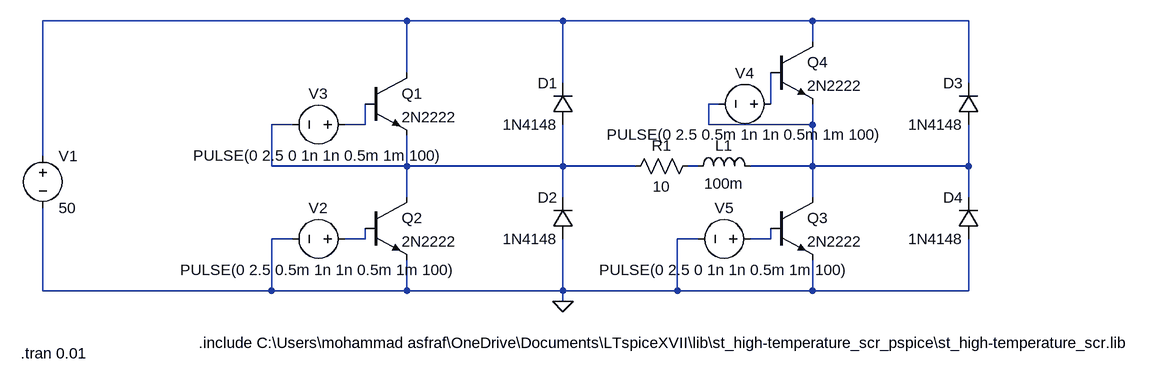
[diagram p0: schematic Single_Phase_Full_Bridge_Inverter_MOS.asc]
Single_Phase_Full_Bridge_Inverter_MOS.asc, the LTspice schematic file:
Version 4
SHEET 1 1236 680
WIRE 352 -160 -208 -160
WIRE 592 -160 352 -160
WIRE 976 -160 592 -160
WIRE 1216 -160 976 -160
WIRE 976 -128 976 -160
WIRE 352 -80 352 -160
WIRE 592 -64 592 -160
WIRE 1216 -64 1216 -160
WIRE 832 -32 816 -32
WIRE 912 -32 912 -80
WIRE 176 0 144 0
WIRE 288 0 288 -32
WIRE 288 0 256 0
WIRE 816 0 816 -32
WIRE 976 0 976 -32
WIRE 976 0 816 0
WIRE -208 48 -208 -160
WIRE 144 64 144 0
WIRE 352 64 352 16
WIRE 352 64 144 64
WIRE 592 64 592 0
WIRE 592 64 352 64
WIRE 704 64 592 64
WIRE 800 64 784 64
WIRE 976 64 976 0
WIRE 976 64 880 64
WIRE 1216 64 1216 0
WIRE 1216 64 976 64
WIRE 352 112 352 64
WIRE 592 112 592 64
WIRE 976 112 976 64
WIRE 1216 112 1216 64
WIRE 176 176 144 176
WIRE 288 176 288 160
WIRE 288 176 256 176
WIRE 800 176 768 176
WIRE 912 176 912 160
WIRE 912 176 880 176
WIRE -208 256 -208 128
WIRE 144 256 144 176
WIRE 144 256 -208 256
WIRE 352 256 352 208
WIRE 352 256 144 256
WIRE 592 256 592 176
WIRE 592 256 352 256
WIRE 768 256 768 176
WIRE 768 256 592 256
WIRE 976 256 976 208
WIRE 976 256 768 256
WIRE 1216 256 1216 176
WIRE 1216 256 976 256
WIRE 592 272 592 256
FLAG 592 272 0
SYMBOL voltage -208 32 R0
WINDOW 123 0 0 Left 0
WINDOW 39 0 0 Left 0
SYMATTR InstName V1
SYMATTR Value 50
SYMBOL diode 608 0 R180
WINDOW 0 24 64 Left 2
WINDOW 3 24 0 Left 2
SYMATTR InstName D1
SYMATTR Value 1N4148
SYMBOL diode 608 176 R180
WINDOW 0 24 64 Left 2
WINDOW 3 24 0 Left 2
SYMATTR InstName D2
SYMATTR Value 1N4148
SYMBOL voltage 272 0 R90
WINDOW 0 -32 56 VBottom 2
WINDOW 3 32 56 VTop 2
WINDOW 123 0 0 Left 0
WINDOW 39 0 0 Left 0
SYMATTR InstName V3
SYMATTR Value PULSE(0 2.5 0 1n 1n 0.5m 1m 100)
SYMBOL diode 1232 0 R180
WINDOW 0 24 64 Left 2
WINDOW 3 24 0 Left 2
SYMATTR InstName D3
SYMATTR Value 1N4148
SYMBOL diode 1232 176 R180
WINDOW 0 24 64 Left 2
WINDOW 3 24 0 Left 2
SYMATTR InstName D4
SYMATTR Value 1N4148
SYMBOL res 800 48 R90
WINDOW 0 0 56 VBottom 2
WINDOW 3 32 56 VTop 2
SYMATTR InstName R1
SYMATTR Value 10
SYMBOL npn 288 -80 R0
SYMATTR InstName Q1
SYMATTR Value 2N2222
SYMBOL npn 288 112 R0
SYMATTR InstName Q2
SYMATTR Value 2N2222
SYMBOL npn 912 112 R0
SYMATTR InstName Q3
SYMATTR Value 2N2222
SYMBOL npn 912 -128 R0
SYMATTR InstName Q4
SYMATTR Value 2N2222
SYMBOL ind 784 80 R270
WINDOW 0 32 56 VTop 2
WINDOW 3 5 56 VBottom 2
SYMATTR InstName L1
SYMATTR Value 100m
SYMBOL voltage 272 176 R90
WINDOW 0 -32 56 VBottom 2
WINDOW 3 32 56 VTop 2
WINDOW 123 0 0 Left 0
WINDOW 39 0 0 Left 0
SYMATTR InstName V2
SYMATTR Value PULSE(0 2.5 0.5m 1n 1n 0.5m 1m 100)
SYMBOL voltage 928 -32 R90
WINDOW 0 -32 56 VBottom 2
WINDOW 3 32 56 VTop 2
WINDOW 123 0 0 Left 0
WINDOW 39 0 0 Left 0
SYMATTR InstName V4
SYMATTR Value PULSE(0 2.5 0.5m 1n 1n 0.5m 1m 100)
SYMBOL voltage 896 176 R90
WINDOW 0 -32 56 VBottom 2
WINDOW 3 32 56 VTop 2
WINDOW 123 0 0 Left 0
WINDOW 39 0 0 Left 0
SYMATTR InstName V5
SYMATTR Value PULSE(0 2.5 0 1n 1n 0.5m 1m 100)
TEXT 32 336 Left 2 !.include C:\\Users\\mohammad asfraf\\OneDrive\\Documents\\LTspiceXVII\\lib\\st_high-temperature_scr_pspice\\st_high-temperature_scr.lib
TEXT -242 352 Left 2 !.tran 0.01

The netlist it stands for:
* Single_Phase_Full_Bridge_Inverter_MOS.asc
V1 N001 0 50
D1 N004 N001 1N4148
D2 0 N004 1N4148
V3 N005 N004 PULSE(0 2.5 0 1n 1n 0.5m 1m 100)
D3 N002 N001 1N4148
D4 0 N002 1N4148
R1 N006 N004 10
Q1 N001 N005 N004 0 2N2222
Q2 N004 N007 0 0 2N2222
Q3 N002 N008 0 0 2N2222
Q4 N001 N003 N002 0 2N2222
L1 N006 N002 100m
V2 N007 0 PULSE(0 2.5 0.5m 1n 1n 0.5m 1m 100)
V4 N003 N002 PULSE(0 2.5 0.5m 1n 1n 0.5m 1m 100)
V5 N008 0 PULSE(0 2.5 0 1n 1n 0.5m 1m 100)
.model D D
.lib standard.dio
.model NPN NPN
.model PNP PNP
.lib standard.bjt
.include C:\Users\mohammad asfraf\OneDrive\Documents\LTspiceXVII\lib\st_high-temperature_scr_pspice\st_high-temperature_scr.lib
.tran 0.01
.backanno
.end